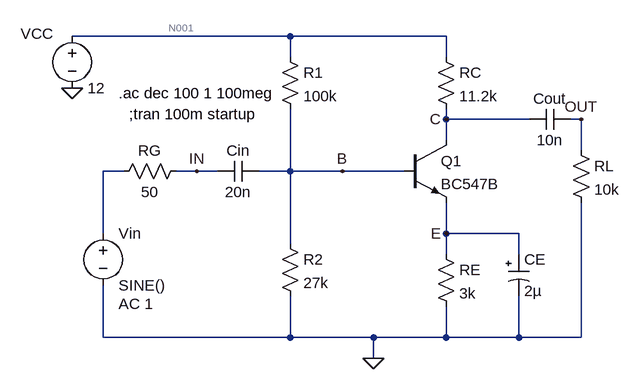
[diagram p0: schematic CircuitoPunto2.asc]
CircuitoPunto2.asc, the LTspice schematic file:
Version 4
SHEET 1 880 680
WIRE 32 96 -304 96
WIRE 272 96 32 96
WIRE 32 128 32 96
WIRE 272 128 272 96
WIRE 272 224 272 208
WIRE 400 224 272 224
WIRE 480 224 464 224
WIRE 272 256 272 224
WIRE 480 272 480 224
WIRE -224 304 -256 304
WIRE -112 304 -144 304
WIRE -80 304 -112 304
WIRE 32 304 32 208
WIRE 32 304 -16 304
WIRE 112 304 32 304
WIRE 208 304 112 304
WIRE -256 400 -256 304
WIRE 272 400 272 352
WIRE 384 400 272 400
WIRE 32 416 32 304
WIRE 272 432 272 400
WIRE 384 432 384 400
WIRE -256 560 -256 480
WIRE 32 560 32 496
WIRE 32 560 -256 560
WIRE 160 560 32 560
WIRE 272 560 272 512
WIRE 272 560 160 560
WIRE 384 560 384 496
WIRE 384 560 272 560
WIRE 480 560 480 352
WIRE 480 560 384 560
WIRE 160 592 160 560
FLAG -304 176 0
FLAG 160 592 0
FLAG 480 224 OUT
FLAG 112 304 B
FLAG 272 224 C
FLAG 272 400 E
FLAG -112 304 IN
SYMBOL npn 208 256 R0
SYMATTR InstName Q1
SYMATTR Value BC547B
SYMBOL res -128 288 R90
WINDOW 0 0 56 VBottom 2
WINDOW 3 32 56 VTop 2
SYMATTR InstName RG
SYMATTR Value 50
SYMBOL cap -16 288 R90
WINDOW 0 0 32 VBottom 2
WINDOW 3 32 32 VTop 2
SYMATTR InstName Cin
SYMATTR Value 20n
SYMBOL res 16 400 R0
SYMATTR InstName R2
SYMATTR Value 27k
SYMBOL res 16 112 R0
SYMATTR InstName R1
SYMATTR Value 100k
SYMBOL res 256 112 R0
SYMATTR InstName RC
SYMATTR Value 11.2k
SYMBOL cap 464 208 R90
WINDOW 0 0 32 VBottom 2
WINDOW 3 32 32 VTop 2
SYMATTR InstName Cout
SYMATTR Value 10n
SYMBOL res 464 256 R0
SYMATTR InstName RL
SYMATTR Value 10k
SYMBOL res 256 416 R0
SYMATTR InstName RE
SYMATTR Value 3k
SYMBOL polcap 368 432 R0
SYMATTR InstName CE
SYMATTR Value 2µ
SYMBOL voltage -256 384 R0
WINDOW 123 24 124 Left 2
WINDOW 39 0 0 Left 0
SYMATTR Value2 AC 1
SYMATTR InstName Vin
SYMATTR Value SINE()
SYMBOL voltage -304 80 R0
WINDOW 0 -79 12 Left 2
SYMATTR InstName VCC
SYMATTR Value 12
TEXT -232 184 Left 2 !.ac dec 100 1 100meg
TEXT -216 216 Left 2 !;tran 100m startup

The netlist it stands for:
* CircuitoPunto2.asc
Q1 C B E 0 BC547B
RG IN N002 50
Cin B IN 20n
R2 B 0 27k
R1 N001 B 100k
RC N001 C 11.2k
Cout OUT C 10n
RL OUT 0 10k
RE E 0 3k
CE E 0 2µ
Vin N002 0 SINE() AC 1
VCC N001 0 12
.model NPN NPN
.model PNP PNP
.lib standard.bjt
.ac dec 100 1 100meg
;tran 100m startup
.backanno
.end

* Results of the author's LTspice run, read from the files saved beside the schematic
* Operating Point, zero values left out:
*   V(c) = 5.003 V
*   V(b) = 2.506 V
*   V(e) = 1.881 V
*   V(n001) = 12 V
*   Ic(Q1) = 624.8 µA
*   Ib(Q1) = 2.123 µA
*   Ie(Q1) = -626.9 µA
*   I(Re) = 626.9 µA
*   I(Rc) = 624.8 µA
*   I(R1) = 94.94 µA
*   I(R2) = 92.82 µA
*   I(Vcc) = -719.7 µA
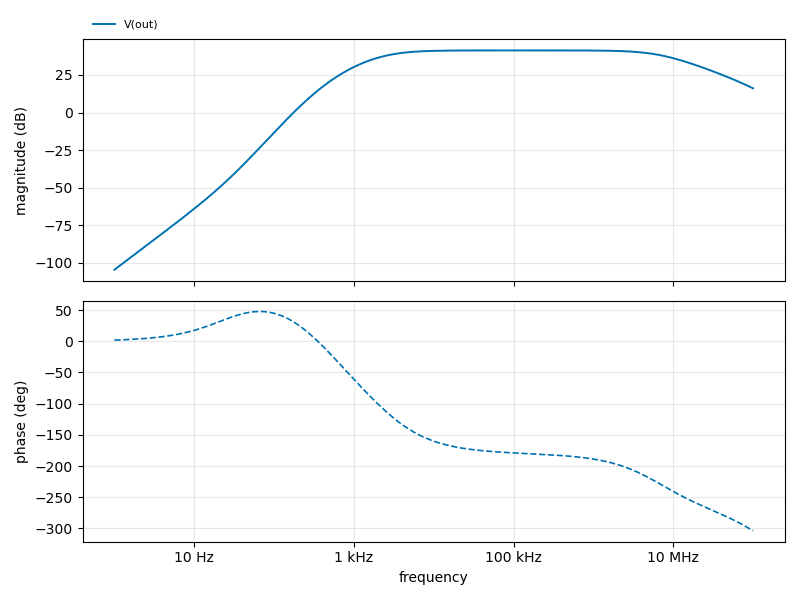
[diagram p1: AC Analysis of CircuitoPunto2.asc, plotted from the saved traces]
* AC Analysis, 1 run:
*   V(out): -104.46 dB at 1 Hz, 16.07 dB at 100 MHz, peak 41.28 dB at 131.8 kHz, 3 dB below the peak at 2.778 kHz and 6.625 MHz